# EAGLE design px4_gps_connector_test (EAGLE 9.6.2)
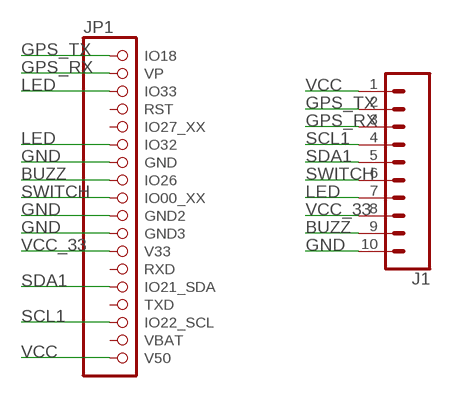
[diagram p0: schematic, sheet 1]

## Parts
J1  CONN_10  [1X10-1.25MM]
JP1  000_ESP32_D1MINI  [00_2X9]

## Nets
BUZZ: J1.9 JP1.8(IO26)
GND [hc]: J1.10 JP1.7(GND) JP1.10(GND2) JP1.11(GND3)
GPS_RX: J1.3 JP1.2(VP)
GPS_TX: J1.2 JP1.1(IO18)
LED: J1.7 JP1.3(IO33) JP1.6(IO32)
SCL1: J1.4 JP1.16(IO22_SCL)
SDA1: J1.5 JP1.14(IO21_SDA)
SWITCH: J1.6 JP1.9(IO00_XX)
VCC [hc]: J1.1 JP1.18(V50)
VCC_33: J1.8 JP1.12(V33)
Unconnected: JP1.4(RST) JP1.5(IO27_XX) JP1.13(RXD) JP1.15(TXD) JP1.17(VBAT)

## Library data of the parts
J1 = SparkFun-Connectors:CONN_10: Multi connection point. Often used as Generic Header-pin footprint for 0.1 inch spaced/style header connections On any of the 0.1 inch spaced packages, you can populate with these: Break Away Headers - Straight <https://www.sparkfun.com/products/116> (PRT-00116) Break Away Male Headers - Right Angle <https://www.sparkfun.com/products/553> (PRT-00553) Female Headers <https://www.sparkfun.com/products/115> (PRT-00115) Break Away Headers - Machine Pin <https://www.sparkfun.com/products/117> (PRT-00117) Break Away Female Headers - Swiss Machine Pin <https://www.sparkfun.com/products/743> (PRT-00743) Arduino Stackable Header - 10 Pin <https://www.sparkfun.com/products/11376> (PRT-11376) For SCREWTERMINALS and SPRING TERMINALS visit here: Screw Terimnals on SparkFun.com <https://www.sparkfun.com/search/results?term=Screw+Terminals> (5mm/3.5mm/2.54mm spacing) This device is also useful as a general connection point to wire up your design to another part of your project. Our various solder wires solder well into these plated through hole pads. Hook-Up Wire - Assortment (Stranded, 22 AWG) <https://www.sparkfun.com/products/11375> (PRT-11375) Hook-Up Wire - Assortment (Solid Core, 22 AWG) <https://www.sparkfun.com/products/11367> (PRT-11367) View the entire wire category on our website here <https://www.sparkfun.com/categories/141> Special notes: Molex polarized connector foot print use with SKU : PRT-08231 with associated crimp pins and housings. 1MM SMD Version SKU: PRT-10208 NOTES ON THE VARIANTS LOCK and LOCK_LONGPADS... This footprint was designed to help hold the alignment of a through-hole component (i.e. 6-pin header) while soldering it into place. You may notice that each hole has been shifted either up or down by 0.005 of an inch from it's more standard position (which is a perfectly straight line). This slight alteration caused the pins (the squares in the middle) to touch the edges of the holes. Because they are alternating, it causes a "brace" to hold the component in place. 0.005 has proven to be the perfect amount of "off-center" position when using our standard breakaway headers. Although looks a little odd when you look at the bare footprint, once you have a header in there, the alteration is very hard to notice. Also,if you push a header all the way into place, it is covered up entirely on the bottom side.
JP1 = microbuilder:000_ESP32_D1MINI: PIN HEADER

## Net classes
3 hc: width 0.762 mm

## Board
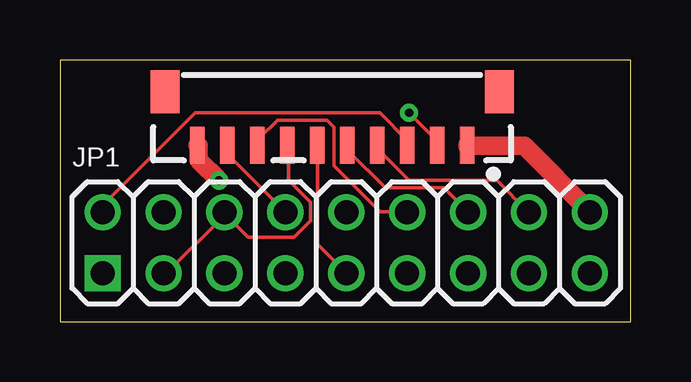
[diagram p1: board, top side]
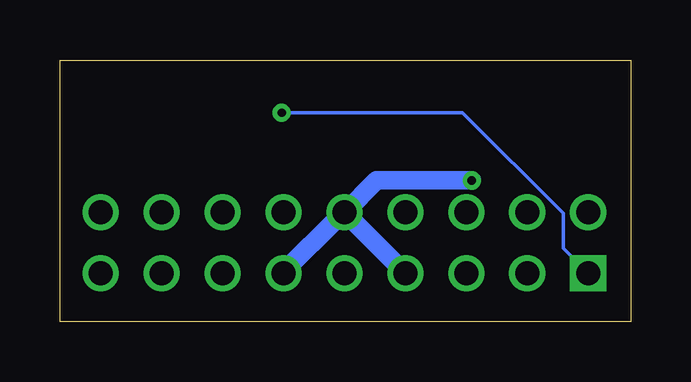
[diagram p2: board, bottom side, seen from below]

Size 23.8 x 10.91 mm. Coordinates in mm from the lower left corner, seen from the top.
Outline: 0,0 23.8,0 23.8,10.91 0,10.91 0,0
Copper layers (1*16): Top 0.035mm / dielectric 1.5mm / Bottom 0.035mm
Design rules "default": minimum track width 6mil, minimum drill 0.35mm, track to track 6mil, track to pad 6mil, pad to pad 6mil, via to via 6mil, smd to smd 6mil, copper to edge 40mil, drill to drill 6mil, minimum pad ring 10mil, minimum via ring 8mil, stop-mask expansion 4mil, vias tented up to drill 0mil, thermal gap 10mil

### Footprints (pad centres in the part's own frame; a part is rotated, then mirrored left to right if it is on the bottom)
1X10-1.25MM = smd 0.6 x 1.55: 1 -3.778,2.54; 2 -2.528,2.54; 3 -1.278,2.54; 4 -0.028,2.54; 5 1.222,2.54; 6 2.472,2.54; 7 3.722,2.54; 8 4.972,2.54; 9 6.222,2.54; 10 7.472,2.54 | smd 1.2 x 1.8: P$1 -5.11,0.315; P$3 8.822,0.315
00_2X9 = drill 1 square: 1 0,0 | drill 1: 2 0,2.54; 3 2.54,0; 4 2.54,2.54; 5 5.08,0; 6 5.08,2.54; 7 7.62,0; 8 7.62,2.54; 9 10.16,0; 10 10.16,2.54; 11 12.7,0; 12 12.7,2.54; 13 15.24,0; 14 15.24,2.54; 15 17.78,0; 16 17.78,2.54; 17 20.32,0; 18 20.32,2.54

### Placement (x,y rotation side)
J1  13.21,9.91 180 top
JP1  1.78,2.03 0 top

### Tracks (layer width: path | path; a pad name or v marks a point on that pad's centre or on a via)
BUZZ
  Top 0.152: JP1.8 7.01,6.96 7.01,7.34 J1.9
GND  (via drill 0.35)
  Top 0.762: v6.63,5.89 5.79,6.73 5.79,7.34 J1.10
  Bottom 0.762: v6.63,5.89 10.59,5.89 11.89,4.6 JP1.10 | JP1.10 JP1.7 | JP1.11 14.48,2.08 12.19,4.37 JP1.10
GPS_RX
  Top 0.152: J1.3 14.48,7.42 14.48,7.57 13.33,8.71 5.64,8.71 1.83,4.9 1.83,4.6 JP1.2
GPS_TX  (via drill 0.35)
  Top 0.152: v14.55,8.71 15.7,7.57 15.7,7.42 J1.2
  Bottom 0.152: v14.55,8.71 7.01,8.71 2.82,4.52 2.82,3.07 JP1.1
LED
  Top 0.152: J1.7 9.53,7.34 9.53,5.89 10.44,4.98 10.44,4.22 9.75,3.53 7.85,3.53 6.86,4.52 JP1.6 6.86,4.45 4.5,2.08 4.34,2.08 JP1.3
SCL1
  Top 0.152: J1.4 13.26,7.34 13.26,7.19 14.55,5.89 18.21,5.89 19.51,4.6 JP1.16
SDA1
  Top 0.152: JP1.14 16,5.59 13.56,5.59 12.04,7.11 12.04,7.34 J1.5
SWITCH
  Top 0.152: JP1.9 10.74,3.23 10.74,7.34 J1.6
VCC
  Top 0.762: J1.1 16.99,7.34 19.36,7.34 22.1,4.6 JP1.18
VCC_33
  Top 0.152: J1.8 8.31,7.42 8.31,7.65 9.07,8.41 11.12,8.41 11.43,8.1 11.43,6.5 13.33,4.6 14.48,4.6 JP1.12